# EAGLE schematic untitled (EAGLE 8.1.0)
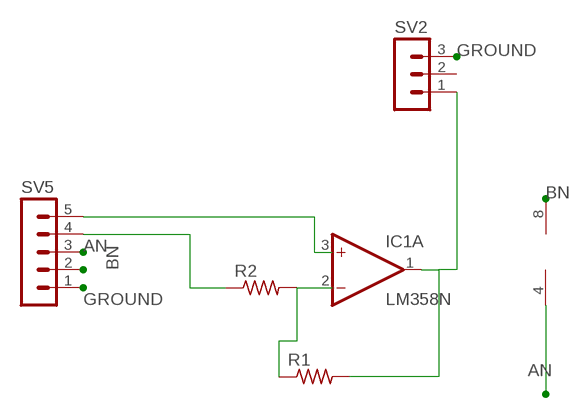
[diagram p0: schematic, sheet 1]

## Parts
IC1  LM358N  [DIL08]
R1  R-US_0204/2V  [0204V]
R2  R-US_0204/2V  [0204V]
SV2  MA03-1  [MA03-1]
SV5  MA05-1  [MA05-1]

## Nets
AN: IC1.4(P:V-) SV5.3
BN: IC1.8(P:V+) SV5.2
GROUND: SV2.3 SV5.1
N$1: R1.1 R2.2
N$2: IC1.1(A:OUT) R1.2 SV2.1
N$3: IC1.3(A:+IN) SV5.5
N$4: R2.1 SV5.4
Unconnected: IC1.2(A:-IN) IC1.5(B:+IN) IC1.6(B:-IN) IC1.7(B:OUT) SV2.2

## Library data of the parts
IC1 = linear:LM358: OP AMP also LM158; LM258; LM2904 Source: http://cache.national.com/ds/LM/LM158.pdf
R1 R2 = resistor:R-US_: RESISTOR, American symbol
SV2 = con-lstb:MA03-1: PIN HEADER; OC_FARNELL: unknown; OC_NEWARK: unknown
SV5 = con-lstb:MA05-1: PIN HEADER; OC_FARNELL: unknown; OC_NEWARK: unknown